# Altium schematic sheet Schematico_Pompa.SchDoc
size A4; SheetNumber: 1; SheetTotal: 1
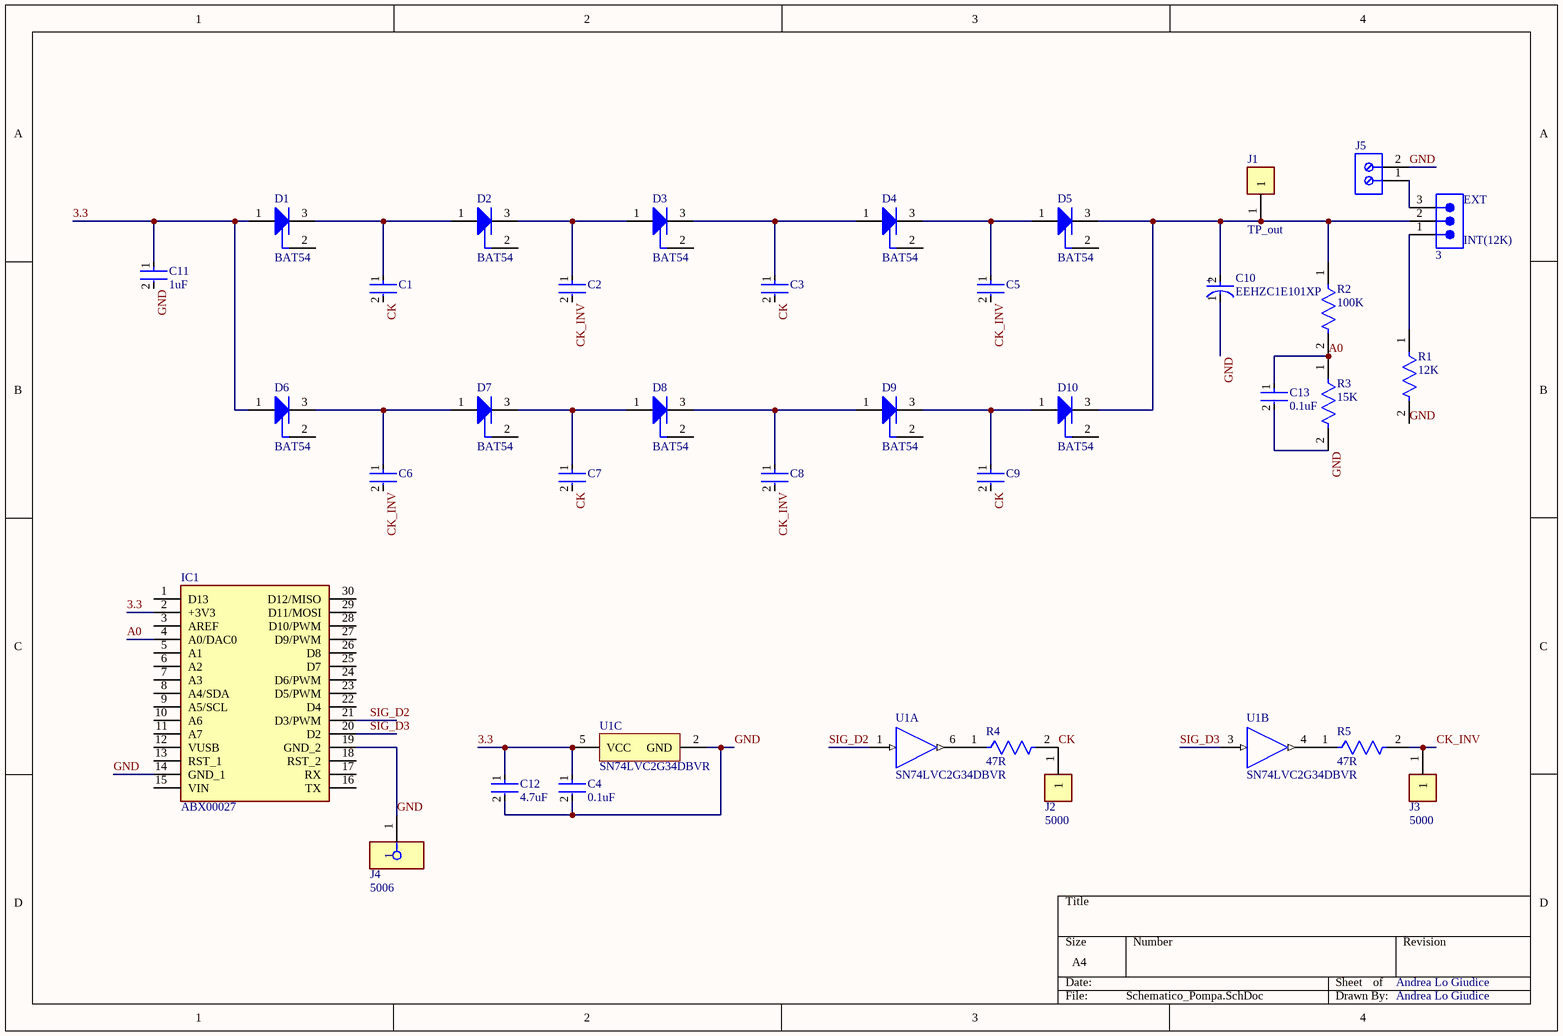
[diagram p0: Schematico_Pompa.SchDoc]

## Parts
3  TSW-103-07-T-S  [SMTC-TSW-103-07-X-S]  (value not drawn)
C1  GRM188Z71E225ME43D  [FP-GRM188-0_2-IPC_C]  (value not drawn)
C2  GRM188Z71E225ME43D  [FP-GRM188-0_2-IPC_C]  (value not drawn)
C3  GRM188Z71E225ME43D  [FP-GRM188-0_2-IPC_C]  (value not drawn)
C4  0.1uF  [FP-C0603C-CF-IPC_B]
C5  GRM188Z71E225ME43D  [FP-GRM188-0_2-IPC_C]  (value not drawn)
C6  GRM188Z71E225ME43D  [FP-GRM188-0_2-IPC_C]  (value not drawn)
C7  GRM188Z71E225ME43D  [FP-GRM188-0_2-IPC_C]  (value not drawn)
C8  GRM188Z71E225ME43D  [FP-GRM188-0_2-IPC_C]  (value not drawn)
C9  GRM188Z71E225ME43D  [FP-GRM188-0_2-IPC_C]  (value not drawn)
C10  EEHZC1E101XP  [FP-EEH-D8-MFG]
C11  1uF  [FP-CC0603-DA-IPC_B]
C12  4.7uF  [FP-CC0603-DA-IPC_B]
C13  0.1uF  [FP-C0603C-CF-IPC_B]
D1  BAT54  [INF-SOT23_L]
D2  BAT54  [INF-SOT23_L]
D3  BAT54  [INF-SOT23_L]
D4  BAT54  [INF-SOT23_L]
D5  BAT54  [INF-SOT23_L]
D6  BAT54  [INF-SOT23_L]
D7  BAT54  [INF-SOT23_L]
D8  BAT54  [INF-SOT23_L]
D9  BAT54  [INF-SOT23_L]
D10  BAT54  [INF-SOT23_L]
IC1  ABX00027  [ABX00027]
J1  TP_out  [FP-5000-MFG]
J2  5000  [FP-5000-MFG]
J3  5000  [FP-5000-MFG]
J4  5006  [FP-5006-MFG]
J5  691214110002  [691214110002]  (value not drawn)
R1  12K  [FP-AT0603-IPC_C]
R2  100K  [FP-CRGP0603-IPC_A]
R3  15K  [FP-AC0603-IPC_C]
R4  47R  [FP-AC0603-IPC_C]
R5  47R  [FP-AC0603-IPC_C]
U1  SN74LVC2G34DBVR  [DBV0006A_N]  (parts A,B,C of 3)

## Nets
3.3: C4.1 C11.1 C12.1 D1.1(A) D6.1(A) IC1.2(+3V3) U1.5(VCC)
A0: C13.1 IC1.4(A0/DAC0) R2.2 R3.1
CK: C1.2 C3.2 C7.2 C9.2 J2.1 R4.2
CK_INV: C2.2 C5.2 C6.2 C8.2 J3.1 R5.2
GND: C4.2 C10.1(C) C11.2 C12.2 C13.2 IC1.14(GND_1) IC1.19(GND_2) J4.1 J5.2 R1.2 R3.2 U1.2(GND)
SIG_D2: IC1.21(D3/PWM) U1.1(1A)
SIG_D3: IC1.20(D2) U1.3(2A)
Net3_1: 3.1 R1.1
Net3_2: 3.2 C10.2(A) D5.3(K) D10.3(K) J1.1 R2.1
Net3_3: 3.3 J5.1
NetC1_1: C1.1 D1.3(K) D2.1(A)
NetC2_1: C2.1 D2.3(K) D3.1(A)
NetC3_1: C3.1 D3.3(K) D4.1(A)
NetC5_1: C5.1 D4.3(K) D5.1(A)
NetC6_1: C6.1 D6.3(K) D7.1(A)
NetC7_1: C7.1 D7.3(K) D8.1(A)
NetC8_1: C8.1 D8.3(K) D9.1(A)
NetC9_1: C9.1 D9.3(K) D10.1(A)
NetR4_1: R4.1 U1.6(1Y)
NetR5_1: R5.1 U1.4(2Y)

Not connected (* = marked no-connect by the designer): D1 2(NC); D2 2(NC); D3 2(NC); D4 2(NC); D5 2(NC); D6 2(NC); D7 2(NC); D8 2(NC); D9 2(NC); D10 2(NC); IC1 1(D13) 3(AREF) 5(A1) 6(A2) 7(A3) 8(A4/SDA) 9(A5/SCL) 10(A6) 11(A7) 12(VUSB) 13(RST_1) 15(VIN) 16(TX) 17(RX) 18(RST_2) 22(D4) 23(D5/PWM) 24(D6/PWM) 25(D7) 26(D8) 27(D9/PWM) 28(D10/PWM) 29(D11/MOSI) 30(D12/MISO)

## Notes on the sheet
- (near 3) EXT
- (near 3) INT(12K)
- Andrea Lo Giudice
- (in symbol CMP-05428-000858-1) +

## Library data of the parts
3 = CMP-1024-00332-1: 0.025" SQ Post Header, Through-hole, Vertical, -55 to 105 degC, 2.54 mm Pitch, 3-Pin, Male, RoHS; Manufacturer: Samtec; Pitch: 2.54 mm; ComponentLink1URL: http://www.samtec.com; ComponentLink3URL: http://www.samtec.com/documents/webfiles/cpdf/TSW-XXX-XX-XXX-X-XX-XXX-MKT.pdf; PartNumber: TSW-103-07-T-S; Mounting Technology: Through-hole; RoHS: True; DatasheetVersion: F-214; PackageVersion: DM, 8/1988; Temperature Range: -55 to 105 degC; ComponentLink2Description: Datasheet; ComponentLink1Description: Manufacturer URL; Orientation: Vertical; PackageReference: TSW-103-07-X-S; ComponentLink3Description: Package Specification; ComponentLink2URL: http://www.samtec.com/documents/webfiles/pdf/TSW_TH.PDF; PackageDescription: .025[0.64] SQ. Post Terminal Strip Assembly
C1-C3 C5-C9 = CMP-06035-003326-1: Chip Multilayer Ceramic Capacitors for General Purpose, 0603, 2.2uF, X7R, 15%, 20%, 25V
C4 C13 = CMP-2006-03067-2: CAP CER 0.1UF 16V X7R 0603; Manufacturer Part Number: C0603C104M4RACTU; Manufacturer: KEMET; Temperature Coefficient: 30ppm/°C; Value: 0.10 μF; Tolerance: 0.2; Material: Ceramic; Automotive Grade: Grade 1; Temperature Range Low: -55°C; ComponentLink2Description: Datasheet; Mouser Description: Multilayer Ceramic Capacitors MLCC - SMD/SMT 16volts 0.1uF X7R 20%; ComponentLink2URL: https://api.kemet.com/component-edge/download/datasheet/C0603C100J5GACAUTO.pdf; Device Class L2: Capacitors; Automotive: Yes; Capacitance: 0.10 μF; Temperature Range High: +125°C; Voltage Rating: 16 V; Lead Free: Yes; Temperature Characteristic: X7R; Package: C0603C-CF; RoHS: TRUE; Device Class L1: Passive Components; Temperature: -55°C to +125°C; Digikey Description: CAP CER 0.1UF 16V X7R 0603; Category: Cap; Device Class L3: Ceramic Capacitors; Octopart: https://octopart.com/c0603c104m4ractu-kemet-134275; Height: 0.87mm
C10 = CMP-05428-000858-1: Conductive Polymer Hybrid Aluminum Electrolytic Capacitors 100uF ±20% 25V RADIAL SMT 6.3x7.7mm; ESR (Equivalent Series Resistance): 30mR; Ripple Current: 1.4A; Leakage Current: 3uA; Life (Hours): 4000Hour; Lead Diameter: 0.65mm; Lead Free: Lead Free; Min Operating Temperature: -55°C; Series: ZC; Mount: Surface Mount; Package Quantity: 900; Tolerance: 20%; Lead Pitch: 1.8mm; Material: Polymer; RoHS Compliant: Yes; Technology: HYBRID; REACH SVHC: No SVHC; Max Operating Temperature: 125°C; Packaging: Tape and Reel; Height: 7.7mm; Ripple Current (AC): 1.4A; Capacitance: 100uF; Termination: SMD/SMT; Voltage: 25V; Number of Pins: 8; Ratings: AEC-Q200; Height - Seated (Max): 0.315inch; Voltage Rating: 25V; Diameter: 6.3mm; Construction: Cylindrical; Radiation Hardening: No; Case/Package: Radial; Voltage Rating (DC): 25V; Length: 7.7mm
C11 = CMP-03422-000101-1: CC0603 1 uF X7R 10.00% 25 V; Manufacturer Part Number: CC0603KPX7R8BB105; Manufacturer: YAGEO; Voltage: 25 V; Temperature Coefficient: 15%; Material: Ceramic; Tolerance: 0.1; Octopart: https://octopart.com/cc0603kpx7r8bb105-yageo-95714672; Footprint Url: http://www.yageo.com/exep/pages/download/literatures/UPY-C_GEN_24.pdf; Temperature: -55°C to +125°C; ComponentLink2URL: http://www.yageo.com/documents/recent/UPY-GPHC_X7R_6.3V-to-50V_18.pdf; Temperature Characteristic: X7R; Automotive: No; Voltage Rating: 25 V; RoHS: TRUE; Lead Free: Yes; Temperature Range High: +125°C; Device Class L3: Ceramic Capacitors; Category: Cap; ComponentLink2Description: Datasheet; Capacitance: 1 uF; Height: 0.9mm; Value: 1 uF; Device Class L1: Passive Components; Package: CC0603-DA; Temperature Range Low: -55°C; Device Class L2: Capacitors
C12 = CMP-03422-001204-1: CAP CER 4.7UF 25V X5R 0603; Manufacturer: YAGEO; Manufacturer Part Number: CC0603MRX5R8BB475; Temperature Coefficient: 15%; Tolerance: 0.2; Material: Ceramic; Category: Cap; Package: CC0603-DA; Capacitance: 4.7 uF; Temperature: -55°C to +125°C; ComponentLink2Description: Datasheet; Octopart: https://octopart.com/cc0603mrx5r8bb475-yageo-81932637; Value: 4.7 uF; Voltage Rating: 25 V; Automotive: No; Device Class L2: Capacitors; Temperature Characteristic: X5R; Height: 0.9mm; Device Class L3: Ceramic Capacitors; Lead Free: Yes; Voltage: 25 V; Footprint Url: http://www.yageo.com/exep/pages/download/literatures/UPY-C_GEN_24.pdf; ComponentLink2URL: http://www.yageo.com/documents/recent/UPY-GPHC_X7R_6.3V-to-50V_18.pdf; Digikey Description: CAP CER 4.7UF 25V X5R 0603; Temperature Range Low: -55°C; Device Class L1: Passive Components; RoHS: TRUE; Temperature Range High: +125°C
D1-D10 = CMP-1182-00010-1: Silicon Schottky Diode, SOT23, Reel, Green; Manufacturer: Infineon; VF (max): 800Â mV; Configuration: Single; IF (max): 200Â mA; CT (max): 10Â pF; Green: TRUE; VR (max): 30Â V; PartNumber: BAT54; ComponentLink2URL: http://www.infineon.com/dgdl/bat54series.pdf?folderId=db3a30431400ef68011425f1ca2505e3&fileId=db3a304314dca3890115190b74210ea6; ComponentLink3Description: Package Specification; PackageVersion: Apr-08; PackageDescription: 3-Pin Small Outline Transistor Package, 1.3 x 2.9 mm Body, 0.95 mm Pitch; ComponentLink1Description: Manufacturer URL; ComponentLink1URL: http://www.infineon.com/; Mounting Technology: Surface Mount; Packing: Reel; ComponentLink2Description: Datasheet; PackageReference: SOT23; ComponentLink3URL: http://www.infineon.com/dgdl/SOT23-Package_Overview.pdf?folderId=db3a30431936bc4b0119532290053c66&fileId=db3a30431936bc4b0119533468123c85
IC1 = ABX00027: Integrated Circuit; Manufacturer_Name: Arduino; Description: Development Boards & Kits - ARM Arduino Nano 33 IoT; Datasheet Link: https://docs.arduino.cc/static/41e9116cd2cb96a5d1375d64250b334c/ABX00027-datasheet.pdf; Manufacturer_Part_Number: ABX00027; Mouser Part Number: 782-ABX00027; Mouser Price/Stock: https://www.mouser.co.uk/ProductDetail/Arduino/ABX00027?qs=PzGy0jfpSMvleC8D9q4oLA%3D%3D; Arrow Part Number: ABX00027; Arrow Price/Stock: https://www.arrow.com/en/products/abx00027/arduino-corporation.html?utm_currency=USD&region=nac
J1-J3 = CMP-19636-000027-1: PC TEST POINT MINIATURE RED; Outside Diameter: 2.54mm; Body Material: Bronze; Number of Contacts: 1; Insulation: Insulated; Inside Diameter: 1.27mm; Hole Diameter: 1.6mm; Plating: Silver; Length: 7.62mm; Package Quantity: 100; Number of Ports: 1; Contact Material: Bronze; Orientation: Straight; RoHS Compliant: Yes; Housing Color: Red; Height: 0.3inch; Series: THM; Lead Free: Lead Free; Color: Red; Contact Plating: Tin; Mount: PCB; Packaging: Bulk; REACH SVHC: No SVHC; Flammability Rating: UL94 V-0; Material: Nylon
J4 = CMP-19636-000022-1: PC TEST POINT COMPACT BLACK; Body Material: Bronze; Inside Diameter: 1.78mm; Number of Ports: 1; Hole Diameter: 1.6mm; Outside Diameter: 3.18mm; Plating: Silver; Contact Plating: Tin; Color: Black; RoHS Compliant: Yes; Flammability Rating: UL94 V-0; Contact Material: Bronze; Material: Nylon; Orientation: Straight; Package Quantity: 100; Housing Color: Black; Length: 8.89mm; Series: THM; Mount: PCB; Height: 0.35inch; Packaging: Bulk; REACH SVHC: No SVHC; Insulation Material: Nylon; Lead Free: Lead Free
J5 = CMP-1502-02464-3: 2141 Series 3.5MM Pitch Straight, Pcb Terminal Block, Through Hole, 2 Way; Plating: Brass, Steel; Wire Gauge (Min): 16AWG; Number of Contacts: 2; Current: 10A; Stripping Length: -6mm; Voltage Rating: 300V; Pitch: 3.5052mm; Wire Gauge (Max): 24AWG; Number of Levels: 1; Lead Pitch: 3.5mm; Width: 7.9mm; Packaging: Box; RoHS: Compliant; Number of Rows: 1; Min Operating Temperature: -40°C; Mount: Through Hole; Number of Pins: 2; Contact Plating: Brass, Tin; Housing Material: Nylon; Current Rating: 10A; Termination: Screw; Color: Blue, Green; Number of Positions Per Level: 2; Height: 8.7mm; Voltage: 300V; Max Operating Temperature: 105°C; Wire/Cable Gauge: 24AWG; Length: 7.4mm; Contact Material: Tin
R1 = CMP-03412-015386-2: Thin Film Chip Resistors Automotive Grade 12kΩ 0.5% 50ppm/°C 0603; Resistance: 12kR; Max Power Dissipation: 100mW; Max Operating Temperature: 155°C; Case/Package: 0603; Packaging: Tape and Reel; Series: AT; Ratings: AEC-Q200; Number of Terminations: 2; Length: 0.063inch; Width: 0.032inch; Height: 0.022inch; Tolerance: 0.5%; Min Operating Temperature: -55°C; Temperature Coefficient: 50ppm/°C; Resistor Type: Thin Film; RoHS Compliant: Yes; Features: Moisture Resistant
R2 = CMP-03211-000885-1: CRGP 0603 100K 1%; Manufacturer: TE; Manufacturer Part Number: CRGP0603F100K; Power Rating: 0.25W; Resistance: 100KΩ; Voltage Rating: 50V; Value: 100KΩ; Tolerance: 0.01; Temperature Coefficient: ±100ppm/°C; Device Class L2: Resistors; Temperature: -55°C to +155°C; Temperature Range High: +155°C; Ambient Temperature Range High: +70°C; Lead Free: Yes; RoHS: TRUE; Octopart: https://octopart.com/crgp0603f100k-te+connectivity-91018719; Digikey Description: CRGP 0603 100K 1%; Automotive: No; ComponentLink2Description: Datasheet; Category: Res; Ipc Land Pattern Name: RESC16080X45; Device Class L3: Chip SMD Resistors; Composition: Thick Film; Temperature Range Low: -55°C; Height: 0.55mm; Device Class L1: Passive Components; Series: CRGP; Package: CRGP0603; ComponentLink2URL: https://www.te.com/commerce/DocumentDelivery/DDEController?Action=srchrtrv&DocNm=9-1773463-9&DocType=DS&DocLang=English
R3 = CMP-03412-044984-1: RES 15kΩ 1.00% 0.2W 0603
R4 R5 = CMP-03412-038070-1: RES 47Ω 5.00% 0.1W 0603
U1 = CMP-0859-00223-3: Dual Buffer Gate, DBV0006A, LARGE T&R; Manufacturer: Texas Instruments; Logic: True; F @ Nom Voltage(Max)(Mhz): 150; Output Type: CMOS; Output Drive (IOL/IOH)(Max)(mA): 32/-32; Voltage(Nom)(V): 1.8,2.5,3.3,5; 3-State Output: No; VCC(Max)(V): 5.5; ICC @ Nom Voltage(Max)(mA): 0.01; Technology Family: LVC; Input Type: CMOS/TTL; VCC(Min)(V): 1.65; Bits(#): 2; tpd @ Nom Voltage(Max)(ns): 8.6,4.4,4.1,3.2; Rating: Catalog; Sub-Family: Non-Inverting Buffer/Driver; Generic Part Number: SN74LVC2G34; Operating Temperature Range(C): -40 to 125,-40 to 85; DatasheetVersion: SCES359I; Schmitt Trigger: No; PackageReference: DBV0006A